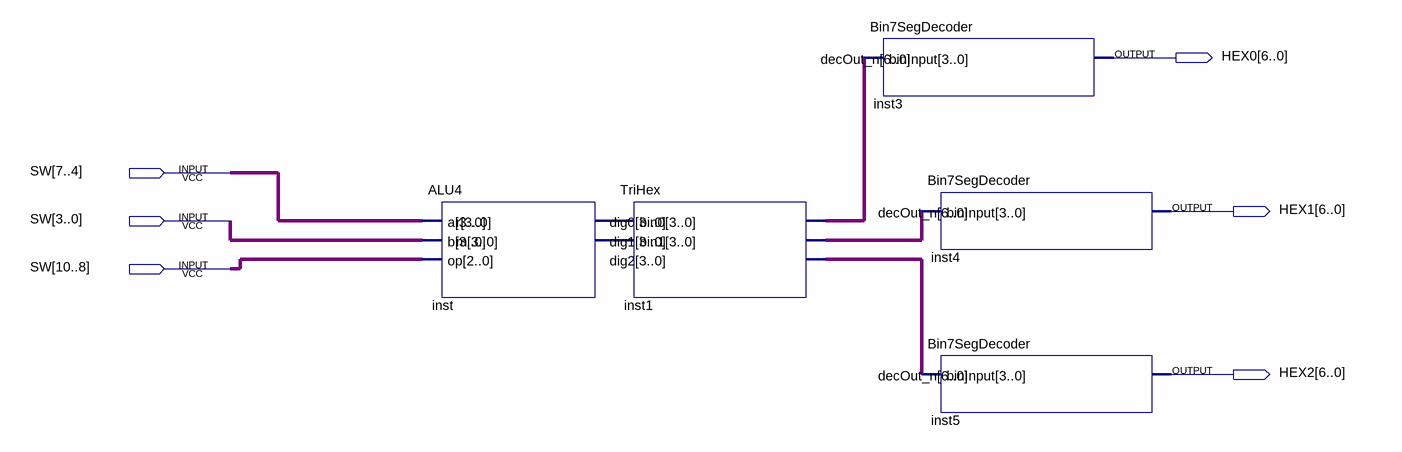
[diagram p0: schematic sheet]
// Quartus schematic ALUTriHexDemo.bdf as structural Verilog: 5 symbols, 6 pins
module ALUTriHexDemo (
  input  [10:0] SW,
  output [6:0] HEX0,
  output [6:0] HEX1,
  output [6:0] HEX2
);

  wire [3:0] inst1_dig0, inst1_dig1, inst1_dig2, inst_m, inst_r;

  ALU4 inst (.a(SW[7:4]), .b(SW[3:0]), .op(SW[10:8]), .r(inst_r), .m(inst_m));
  TriHex inst1 (.bin0(inst_r), .bin1(inst_m), .dig0(inst1_dig0), .dig1(inst1_dig1), .dig2(inst1_dig2));
  Bin7SegDecoder inst3 (.binInput(inst1_dig0), .decOut_n(HEX0));
  Bin7SegDecoder inst4 (.binInput(inst1_dig1), .decOut_n(HEX1));
  Bin7SegDecoder inst5 (.binInput(inst1_dig2), .decOut_n(HEX2));
endmodule
